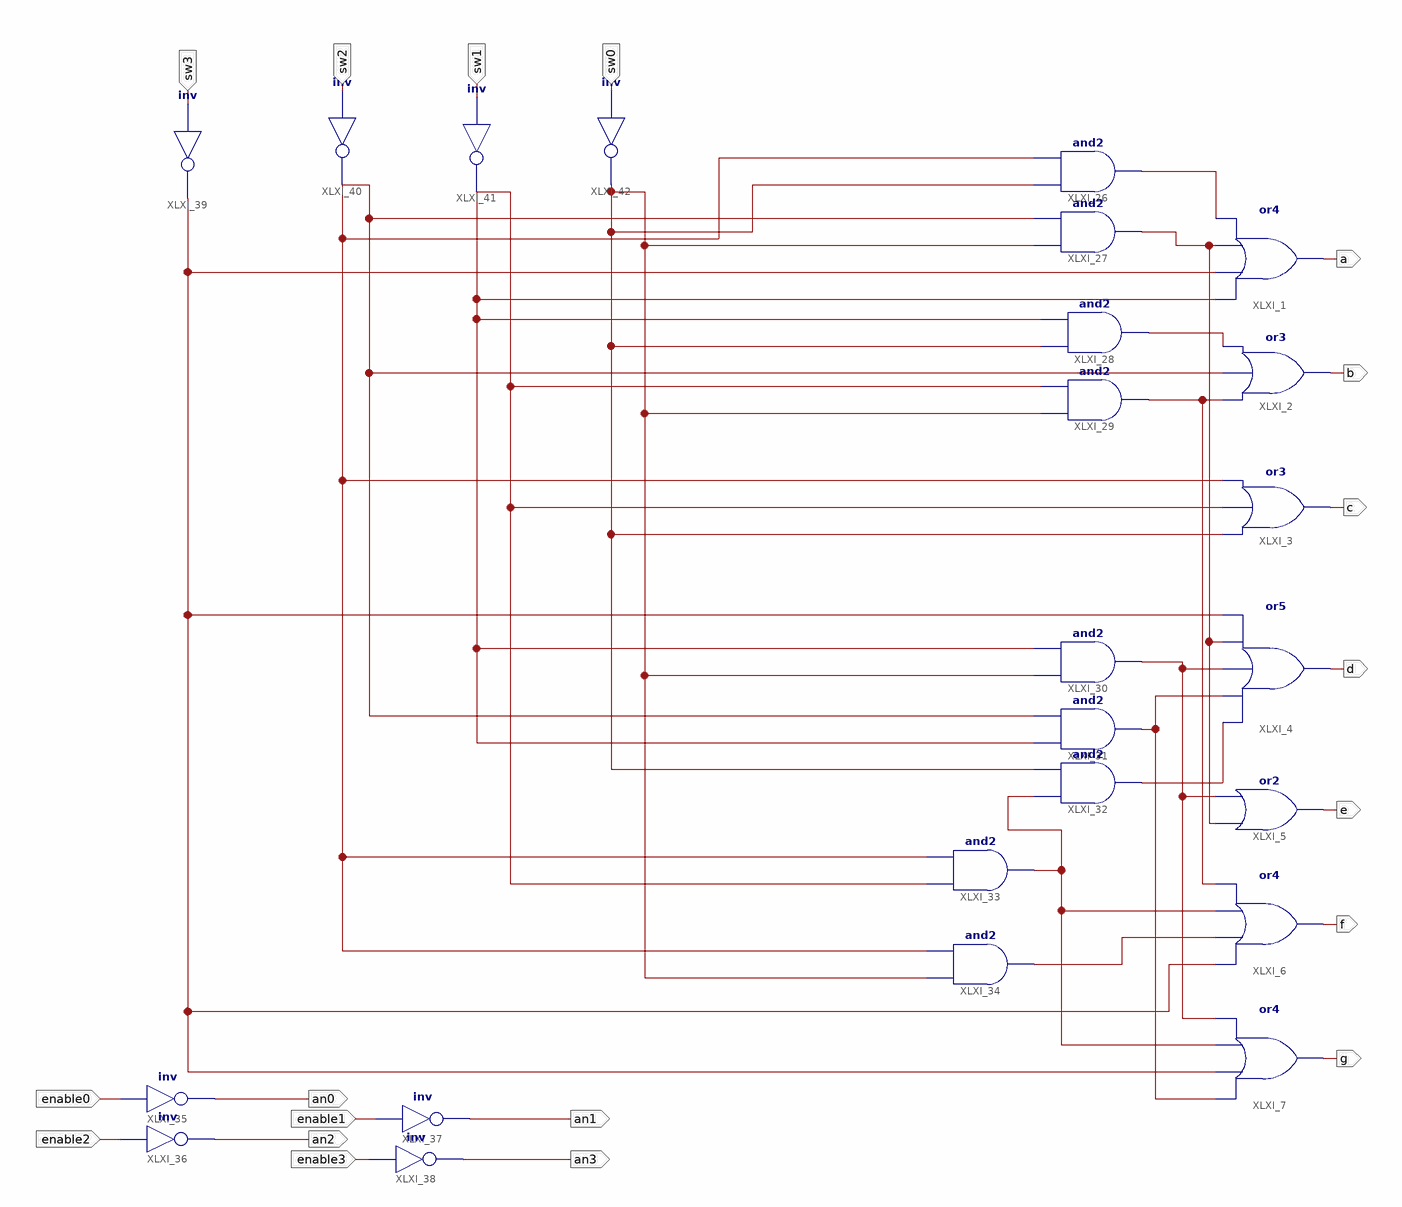
[diagram p0: schematic sheet 1]
// Xilinx ISE schematic bcd_to_7led_bh_sch.sch (spartan3e) as structural Verilog: 24 symbols, 19 ports
module bcd_to_7led_bh_sch (
  input  sw1,
  input  sw2,
  input  sw3,
  input  enable0,
  input  enable2,
  input  enable1,
  input  enable3,
  input  sw0,
  output a,
  output b,
  output c,
  output d,
  output e,
  output f,
  output g,
  output an0,
  output an1,
  output an2,
  output an3
);

  wire XLXN_34, XLXN_36, XLXN_37, XLXN_39, XLXN_40, XLXN_41, XLXN_42, XLXN_44, XLXN_45;

  or XLXI_1 (a, sw2, sw0, XLXN_36, XLXN_34);
  or XLXI_2 (b, XLXN_39, sw1, XLXN_37);
  or XLXI_3 (c, sw3, sw2, sw1);
  or XLXI_4 (d, XLXN_42, XLXN_41, XLXN_40, XLXN_36, sw0);
  or XLXI_5 (e, XLXN_36, XLXN_40);
  or XLXI_6 (f, sw0, XLXN_45, XLXN_44, XLXN_39);
  or XLXI_7 (g, XLXN_41, sw0, XLXN_44, XLXN_40);
  and XLXI_26 (XLXN_34, sw3, sw1);
  and XLXI_27 (XLXN_36, sw3, sw1);
  and XLXI_28 (XLXN_37, sw3, sw2);
  and XLXI_29 (XLXN_39, sw3, sw2);
  and XLXI_30 (XLXN_40, sw3, sw2);
  and XLXI_31 (XLXN_41, sw2, sw1);
  and XLXI_32 (XLXN_42, XLXN_44, sw3);
  and XLXI_33 (XLXN_44, sw2, sw1);
  and XLXI_34 (XLXN_45, sw3, sw1);
  not XLXI_35 (an0, enable0);
  not XLXI_36 (an2, enable2);
  not XLXI_37 (an1, enable1);
  not XLXI_38 (an3, enable3);
  not XLXI_39 (sw0, sw3);
  not XLXI_40 (sw1, sw2);
  not XLXI_41 (sw2, sw1);
  not XLXI_42 (sw3, sw0);
endmodule
